# Altium schematic sheet Connectors.SchDoc
size A
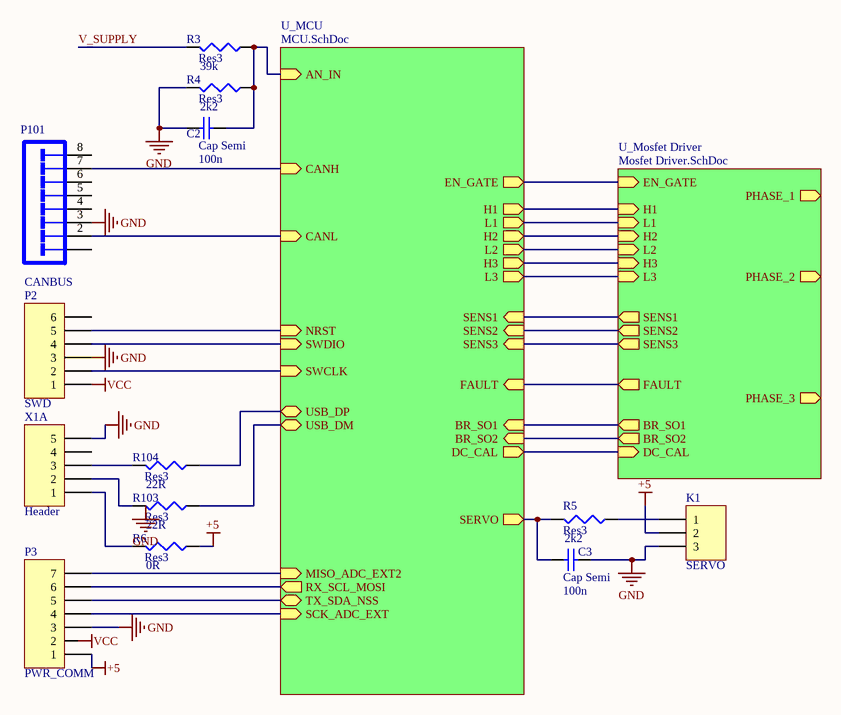
[diagram p0: Connectors.SchDoc]

## Parts
C2  Cap Semi  value 100n  [1608[0603]]
C3  Cap Semi  value 100n  [1608[0603]]
K1  SERVO  [HDR1X3]
P2  SWD  [HDR1X6]
P3  PWR_COMM  [HDR1X7]
P101  CANBUS  [TECO-215877-1_V]
R3  Res3  value 39k  [J1-0603]
R4  Res3  value 2k2  [J1-0603]
R5  Res3  value 2k2  [J1-0603]
R6  Res3  value 0R  [J1-0603]
R103  Res3  value 22R  [J1-0603]
R104  Res3  value 22R  [J1-0603]
X1A  Header  [HDR1X5]

## Sub-sheets
U_MCU = MCU.SchDoc: CANL (in), CANH (in), NRST (in), SENS3 (in), SENS2 (in), SENS1 (in), SCK_ADC_EXT (in), MISO_ADC_EXT2 (in), H3 (out), H2 (out), H1 (out), USB_DM (bidir), USB_DP (bidir), EN_GATE (out), FAULT (in), BR_SO2 (in), BR_SO1 (in), SERVO (out), AN_IN (in), L1 (out), L2 (out), L3 (out), RX_SCL_MOSI (out), SWDIO (in), SWCLK (in), DC_CAL (out), TX_SDA_NSS (bidir)
U_Mosfet Driver = Mosfet Driver.SchDoc: SENS1 (out), SENS2 (out), SENS3 (out), DC_CAL (in), EN_GATE (in), H1 (in), L1 (in), H2 (in), L2 (in), H3 (in), L3 (in), BR_SO2 (out), BR_SO1 (out), FAULT (out), PHASE_2 (out), PHASE_3 (out), PHASE_1 (out)

## Nets
+5: K1.2 P3.1 R6.1
GND: C2.2 C3.1 K1.3 P2.3 P3.3 P101.3 R4.2 X1A.5
VCC: P2.1
V_SUPPLY: R3.2
NetC2_1: C2.1 R3.1 R4.1 ; sheet U_MCU/AN_IN
NetC3_2: C3.2 R5.2 ; sheet U_MCU/SERVO
NetK1_1: K1.1 R5.1
NetP2_2: P2.2 ; sheet U_MCU/SWCLK
NetP2_4: P2.4 ; sheet U_MCU/SWDIO
NetP2_5: P2.5 ; sheet U_MCU/NRST
NetP3_4: P3.4 ; sheet U_MCU/SCK_ADC_EXT
NetP3_5: P3.5 ; sheet U_MCU/TX_SDA_NSS
NetP3_6: P3.6 ; sheet U_MCU/RX_SCL_MOSI
NetP3_7: P3.7 ; sheet U_MCU/MISO_ADC_EXT2
NetP101_2: P101.2 ; sheet U_MCU/CANL
NetP101_7: P101.7 ; sheet U_MCU/CANH
NetR6_2: R6.2 X1A.1
NetR103_1: R103.1 ; sheet U_MCU/USB_DM
NetR103_2: R103.2 X1A.2
NetR104_1: R104.1 ; sheet U_MCU/USB_DP
NetR104_2: R104.2 X1A.3
(unnamed): sheet U_Mosfet Driver/SENS1, sheet U_MCU/SENS1
(unnamed): sheet U_Mosfet Driver/SENS2, sheet U_MCU/SENS2
(unnamed): sheet U_Mosfet Driver/SENS3, sheet U_MCU/SENS3
(unnamed): sheet U_Mosfet Driver/DC_CAL, sheet U_MCU/DC_CAL
(unnamed): sheet U_Mosfet Driver/EN_GATE, sheet U_MCU/EN_GATE
(unnamed): sheet U_Mosfet Driver/H1, sheet U_MCU/H1
(unnamed): sheet U_Mosfet Driver/L1, sheet U_MCU/L1
(unnamed): sheet U_Mosfet Driver/H2, sheet U_MCU/H2
(unnamed): sheet U_Mosfet Driver/L2, sheet U_MCU/L2
(unnamed): sheet U_Mosfet Driver/H3, sheet U_MCU/H3
(unnamed): sheet U_Mosfet Driver/L3, sheet U_MCU/L3
(unnamed): sheet U_Mosfet Driver/BR_SO2, sheet U_MCU/BR_SO2
(unnamed): sheet U_Mosfet Driver/BR_SO1, sheet U_MCU/BR_SO1
(unnamed): sheet U_Mosfet Driver/FAULT, sheet U_MCU/FAULT

Not connected (* = marked no-connect by the designer): P2 6; P3 2; P101 1 4 5 6 8; X1A 4

## Notes on the sheet
- Labels drawn without touching a wire or pin: GND, VCC

## Library data of the parts
C2 C3 = Cap Semi: Capacitor (Semiconductor SIM Model); Published: 8-Jun-2000; LatestRevisionDate: 29-May-2009; LatestRevisionNote: IPC-7351 Footprint Added.; PackageReference: C1206; Publisher: Altium Limited; PackageDescription: Chip Capacitor
K1 = Header 3: Header, 3-Pin; LatestRevisionDate: 17-Jul-2002; LatestRevisionNote: Re-released for DXP Platform.; Publisher: Altium Limited
P2 = Header 6: Header, 6-Pin; LatestRevisionDate: 17-Jul-2002; LatestRevisionNote: Re-released for DXP Platform.; Publisher: Altium Limited
P3 = Header 7: Header, 7-Pin; LatestRevisionDate: 17-Jul-2002; LatestRevisionNote: Re-released for DXP Platform.; Publisher: Altium Limited
P101 = 215877-1: Female Header, Pitch 2.54 mm, 2 x 4 Position, Height 11.5 mm, Tail Length 3 mm, -40 to 105 degC, RoHS, Tape and Reel; Dynamic Catalog: Modular Jacks; Other Names: A105009CT; Number of Ports: 1; Connector Type: Jack; LED Color: Does Not Contain LED; Ratings: Cat3; Number of Positions/Contacts: 8p8c (RJ45, Ethernet); 3D Model: 215877-1.pdf; Tab Direction: Down; Shielding: Unshielded; DatasheetVersion: Rev. AE; PackageReference: THD; Supplier 1: Digi-Key; Supplier Part Number 1: A105009TR-ND; Supplier 2: Digi-Key; Supplier Part Number 2: A105009CT-ND; Features: Board Lock; Packaging: Cut Tape (CT); Termination: Solder; Family: Modular Connectors - Jacks; Contact Finish: Gold; Housing Material: Polybutylene Terephthalate (PBT); RoHS Information: 215877-1 Statement of Compliance; Mounting Type: Through Hole; Contact Material: Phosphor Bronze; Orientation: 90° Angle (Right); Standard Package: 1; Number of Rows: 1; Category: Connectors, Interconnects; ComponentLink1Description: Manufacturer URL; ComponentLink1URL: http://www.te.com; ComponentLink2Description: Datasheet; ComponentLink2URL: https://datasheet.ciiva.com/16310/215877-1-16310656.pdf
R3-R6 R103 R104 = Res3: Resistor; Published: 8-Jun-2000; LatestRevisionDate: 29-May-2009; LatestRevisionNote: IPC-7351 Footprint Added.; PackageReference: J1-0603; Publisher: Altium Limited; PackageDescription: Chip Resistor
X1A = Header 5: Header, 5-Pin; LatestRevisionDate: 17-Jul-2002; LatestRevisionNote: Re-released for DXP Platform.; Publisher: Altium Limited